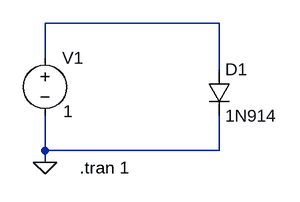
[diagram p0: schematic Diode_1.asc]
Diode_1.asc, the LTspice schematic file:
Version 4
SHEET 1 880 680
WIRE 288 112 48 112
WIRE 48 160 48 112
WIRE 288 176 288 112
WIRE 48 288 48 240
WIRE 288 288 288 240
WIRE 288 288 48 288
WIRE 48 304 48 288
FLAG 48 304 0
SYMBOL voltage 48 144 R0
WINDOW 3 25 90 Left 2
WINDOW 123 0 0 Left 0
WINDOW 39 0 0 Left 0
SYMATTR Value 1
SYMATTR InstName V1
SYMBOL diode 272 176 R0
SYMATTR InstName D1
SYMATTR Value 1N914
TEXT 96 312 Left 2 !.tran 1

The netlist it stands for:
* Diode_1.asc
V1 N001 0 1
D1 N001 0 1N914
.model D D
.lib standard.dio
.tran 1
.backanno
.end